# Altium project Driver.PrjPcb
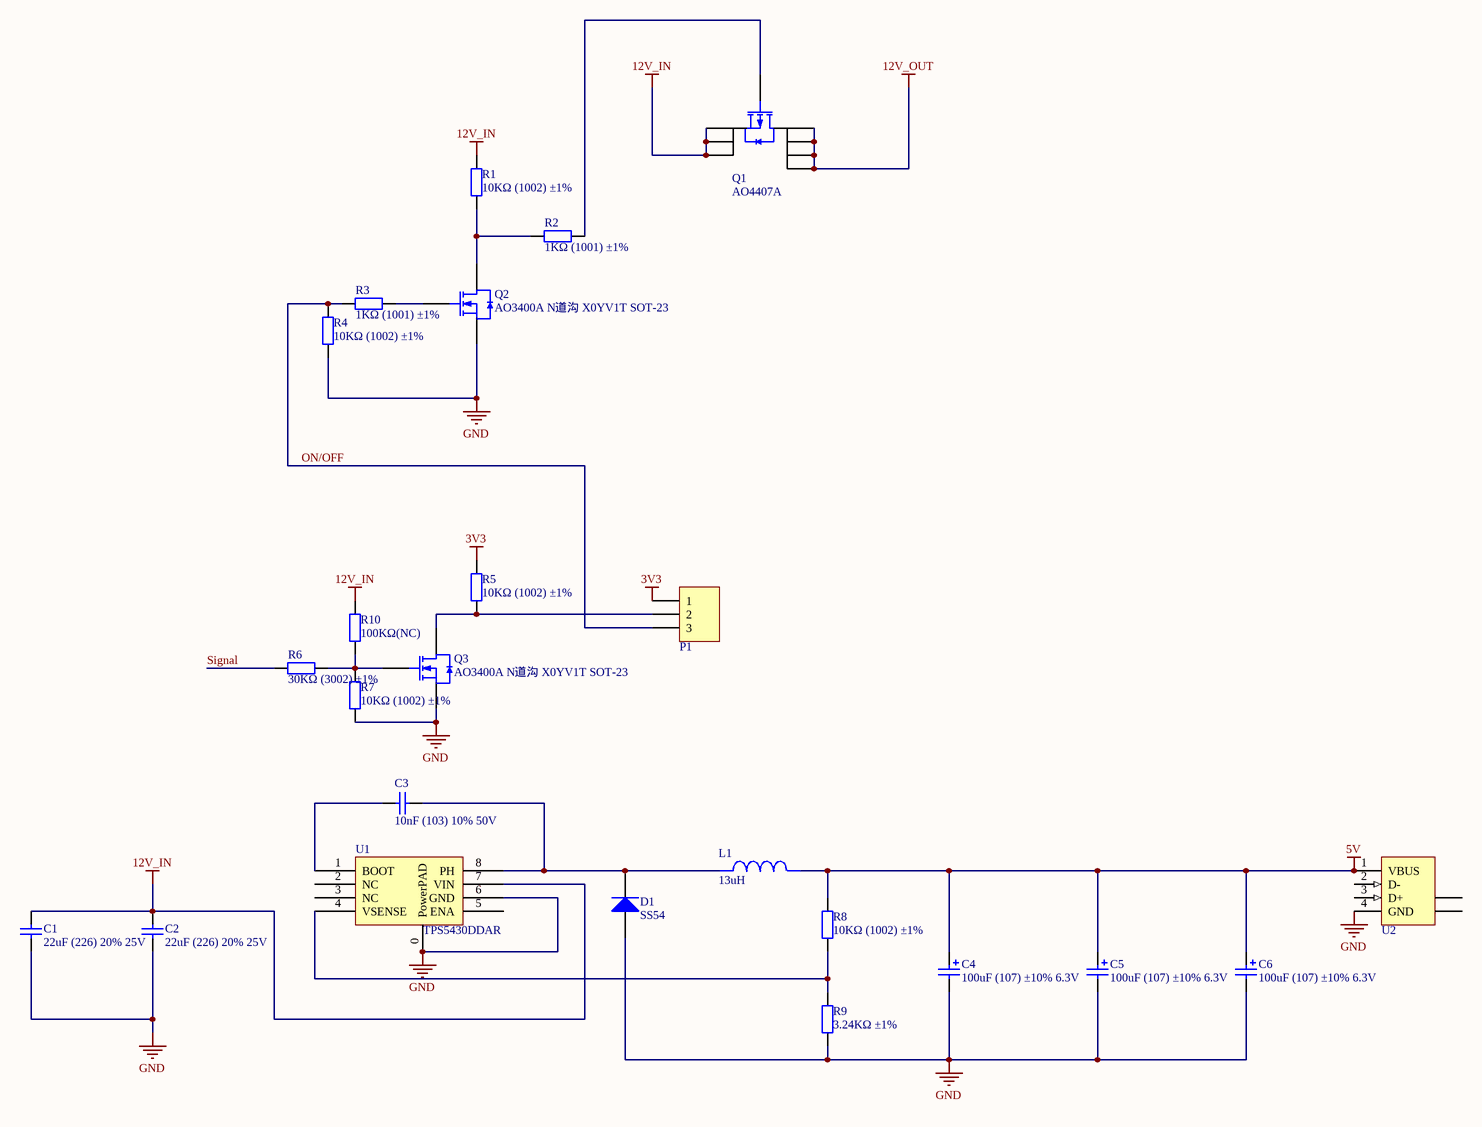
[diagram p0: Driver.SchDoc]
1 sheet, 24 parts. Net scope: global (net labels, ports and power ports of the same name join across sheets).
Board file: driver.PcbDoc

## Sheet Driver.SchDoc
size A2

### Parts
C1  22uF (226) 20% 25V  [0805_C]
C2  22uF (226) 20% 25V  [0805_C]
C3  10nF (103) 10% 50V  [0603_C]
C4  100uF (107) ±10% 6.3V  [CASE-B_3528]
C5  100uF (107) ±10% 6.3V  [CASE-B_3528]
C6  100uF (107) ±10% 6.3V  [CASE-B_3528]
D1  SS54  [SMA(DO-214AC)_S1]
L1  value 13uH  [WE-PDF-1045]  (hidden comment: 7447798131)
P1  0.1" 3POS Header SNGL  [3 POS HEADER SINGLE ROW]  (value not drawn)
Q1  AO4407A  [SOIC-8_150mil]
Q2  AO3400A N道沟 X0YV1T SOT-23  [SOT-23-3L]
Q3  AO3400A N道沟 X0YV1T SOT-23  [SOT-23-3L]
R1  10KΩ (1002) ±1%  [0603_R]
R2  1KΩ (1001) ±1%  [0603_R]
R3  1KΩ (1001) ±1%  [0603_R]
R4  10KΩ (1002) ±1%  [0603_R]
R5  10KΩ (1002) ±1%  [0603_R]
R6  30KΩ (3002) ±1%  [0603_R]
R7  10KΩ (1002) ±1%  [0603_R]
R8  10KΩ (1002) ±1%  [0603_R]
R9  3.24KΩ ±1%  [0603_R]
R10  100KΩ(NC)  [0603_R]
U1  TPS5430DDAR  [SOP-8_EP_150mil]
U2  CONN RCPT USB TYPE A R/A GOLD  [USB_A_RA_THRU]  (value not drawn)

### Nets
3V3: P1.1 R5.2
5V: C4.1 C5.1 C6.1 L1.2 R8.2 U2.1(VBUS)
12V_IN: C1.2 C2.2 Q1.1(S) Q1.2(S) Q1.3(S) R1.2 R10.2 U1.7(VIN)
12V_OUT: Q1.5(D) Q1.6(D) Q1.7(D) Q1.8(D)
GND: C1.1 C2.1 C4.2 C5.2 C6.2 D1.1(A) Q2.2(S) Q3.2(S) R4.1 R7.1 R9.1 U1.0(PowerPAD) U1.6(GND) U2.4(GND)
ON/OFF: P1.3 R3.1 R4.2
Signal: R6.1
NetC3_1: C3.1 D1.2(K) L1.1 U1.8(PH)
NetC3_2: C3.2 U1.1(BOOT)
NetP1_2: P1.2 Q3.3(D) R5.1
NetQ1_4: Q1.4(G) R2.2
NetQ2_1: Q2.1(G) R3.2
NetQ2_3: Q2.3(D) R1.1 R2.1
NetQ3_1: Q3.1(G) R6.2 R7.2 R10.1
NetR8_1: R8.1 R9.2 U1.4(VSENSE)

Not connected (* = marked no-connect by the designer): U1 2(NC) 3(NC) 5(ENA); U2 2(D-) 3(D+) 5(SHLD) 6(SHLD)

### Library data of the parts
C1 C2 = 0805 22uF (226) 20% 25V: 贴片电容; ComponentLink1Description: 供应商链接; ComponentLink1URL: http://www.szlcsc.com/product/details_46786.html; Package: 0805; Supplier: LC; SuppliersPartNumber: C45783
C3 = 0603 10nF (103) 10% 50V: 贴片电容; ComponentLink1Description: 供应商链接; ComponentLink1URL: http://www.szlcsc.com/product/details_58143.html; Package: 0603; Supplier: LC; SuppliersPartNumber: C57112
C4-C6 = 3528 100uF (107) 10% 6.3V: 钽电容; ComponentLink1Description: 供应商链接; ComponentLink1URL: http://www.szlcsc.com/product/details_16815.html; Package: 3528; Supplier: LC; SuppliersPartNumber: C16133
D1 = SMA(DO-214AC) SS54: 二极管; ComponentLink1Description: 供应商链接; ComponentLink1URL: http://www.szlcsc.com/product/details_23178.html; Package: SMA(DO-214AC); Supplier: LC; SuppliersPartNumber: C22452
L1 = 7447798131: Unknown; Manufacturer Name: Wurth Elektronik; PackageReference: 7447798131; Manufacturer Part Number: 7447798131
P1 = CONN HEADER 3POS .100" SNGL TIN: Manufacturer: Samtec Inc; Manufacturer Part Number: TSW-150-08-T-S; Unit Price in Quantity: 1.0189; Part Number: CONN HEADER 3POS .100" SNGL TIN; Mounting Type: thru-hole; Package: header; Component Type: Standard; Pin Count: 3; Supplier 1: Digikey; Supplier 1 Part Number: SAM1050-50-ND; Unit Price-Supplier 1: 2.24; Price Break: 1000; Vendor/Distributor: Digikey
Q1 = AO4407A: MOS(场效应管); ComponentLink1Description: 供应商链接; ComponentLink1URL: http://www.szlcsc.com/product/details_16754.html; Package: SOIC-8_150mil; Supplier: LC; SuppliersPartNumber: C16072
Q2 Q3 = AO3400A N道沟 X0YV1T SOT-23: MOS(场效应管); ComponentLink1Description: 供应商链接; ComponentLink1URL: http://www.szlcsc.com/product/details_21629.html; Package: SOT-23; Supplier: LC; SuppliersPartNumber: C20917
R1 R4 R5 R7 R8 = 0603 10KΩ (1002) 1%: 贴片电阻; ComponentLink1Description: 供应商链接; ComponentLink1URL: http://www.szlcsc.com/product/details_26547.html; Package: 0603; Supplier: LC; SuppliersPartNumber: C25804
R2 R3 = 0603 1KΩ (1001) 1%: 贴片电阻; ComponentLink1Description: 供应商链接; ComponentLink1URL: http://www.szlcsc.com/product/details_21904.html; Package: 0603; Supplier: LC; SuppliersPartNumber: C21190
R6 = 0603 30KΩ (3002) 1%: 贴片电阻; ComponentLink1Description: 供应商链接; ComponentLink1URL: http://www.szlcsc.com/product/details_23711.html; Package: 0603; Supplier: LC; SuppliersPartNumber: C22984
R9 = 0603 3KΩ (3001) 1%: 贴片电阻; ComponentLink1Description: 供应商链接; ComponentLink1URL: http://www.szlcsc.com/product/details_4618.html; Package: 0603; Supplier: LC; SuppliersPartNumber: C4211
R10 = 0603 100KΩ (1003) 1%: 贴片电阻; ComponentLink1Description: 供应商链接; ComponentLink1URL: http://www.szlcsc.com/product/details_26546.html; Package: 0603; Supplier: LC; SuppliersPartNumber: C25803
U1 = TPS5430DDAR_[C9864]: DC-DC芯片; Notepad: 0 pin:        GND pin must be connected to the exposed pad for proper operation.; ComponentLink1Description: 供应商链接; ComponentLink1URL: http://www.szlcsc.com/product/details_10396.html; Package: SOP-8_EP_150mil; Supplier: LC; SuppliersPartNumber: C9864
U2 = CONN RCPT USB TYPE A R/A GOLD: Manufacturer: Amphenol Commercial Products; Manufacturer Part Number: UE27AC54100; Unit Price in Quantity: .289; Part Number: CONN RCPT USB TYPE A R/A GOLD; Mounting Type: thru-hole; Package: header; Component Type: Standard; Pin Count: 4; Supplier 1: Digikey; Supplier 1 Part Number: UE27AC54100-ND; Part URL-Supplier 1: http://www.digikey.com/product-search/en?x=0&y=0&lang=en&site=us&KeyWords=UE27AC54100-ND; Unit Price-Supplier 1: .85; Price Break: 1000; Vendor/Distributor: Digikey